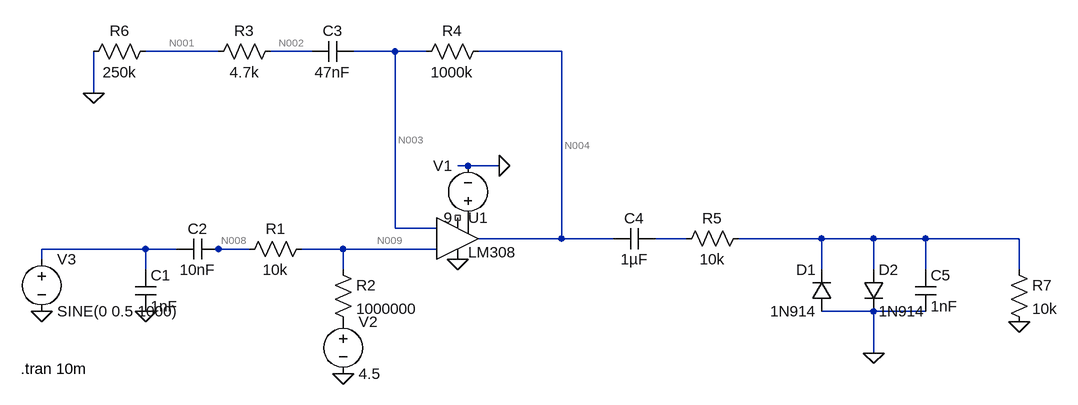
[diagram p0: schematic spice_simulation.asc]
spice_simulation.asc, the LTspice schematic file:
Version 4
SHEET 1 1752 680
WIRE -240 -256 -352 -256
WIRE -96 -256 -160 -256
WIRE 32 -256 -32 -256
WIRE 80 -256 32 -256
WIRE 288 -256 160 -256
WIRE -432 -192 -432 -256
WIRE 144 -80 128 -80
WIRE 192 -80 144 -80
WIRE 32 16 32 -256
WIRE 96 16 32 16
WIRE 288 32 288 -256
WIRE 288 32 160 32
WIRE 368 32 288 32
WIRE 480 32 432 32
WIRE 688 32 560 32
WIRE 768 32 688 32
WIRE 848 32 768 32
WIRE 992 32 848 32
WIRE -352 48 -512 48
WIRE -304 48 -352 48
WIRE -240 48 -256 48
WIRE -192 48 -240 48
WIRE -48 48 -112 48
WIRE 96 48 -48 48
WIRE -512 64 -512 48
WIRE -352 80 -352 48
WIRE -48 80 -48 48
WIRE 688 80 688 32
WIRE 768 80 768 32
WIRE 848 80 848 32
WIRE 992 80 992 32
WIRE 768 144 688 144
WIRE 848 144 768 144
WIRE 768 208 768 144
FLAG -432 -192 0
FLAG -352 144 0
FLAG 768 208 0
FLAG 992 160 0
FLAG -48 240 0
FLAG 192 -80 0
FLAG -512 144 0
FLAG 128 64 0
DATAFLAG 144 -80 ""
DATAFLAG 80 -256 ""
DATAFLAG 80 -256 ""
SYMBOL OpAmps\\LM308 128 -32 R0
WINDOW 3 16 85 Left 2
SYMATTR InstName U1
SYMBOL cap -368 80 R0
SYMATTR InstName C1
SYMATTR Value 1nF
SYMBOL cap -240 32 R90
WINDOW 0 0 32 VBottom 2
WINDOW 3 32 32 VTop 2
SYMATTR InstName C2
SYMATTR Value 10nF
SYMBOL cap -32 -272 R90
WINDOW 0 0 32 VBottom 2
WINDOW 3 32 32 VTop 2
SYMATTR InstName C3
SYMATTR Value 47nF
SYMBOL cap 432 16 R90
WINDOW 0 0 32 VBottom 2
WINDOW 3 32 32 VTop 2
SYMATTR InstName C4
SYMATTR Value 1µF
SYMBOL res -96 32 R90
WINDOW 0 0 56 VBottom 2
WINDOW 3 32 56 VTop 2
SYMATTR InstName R1
SYMATTR Value 10k
SYMBOL res -64 64 R0
SYMATTR InstName R2
SYMATTR Value 1000000
SYMBOL res -144 -272 R90
WINDOW 0 0 56 VBottom 2
WINDOW 3 32 56 VTop 2
SYMATTR InstName R3
SYMATTR Value 4.7k
SYMBOL res 176 -272 R90
WINDOW 0 0 56 VBottom 2
WINDOW 3 32 56 VTop 2
SYMATTR InstName R4
SYMATTR Value 1000k
SYMBOL res 576 16 R90
WINDOW 0 0 56 VBottom 2
WINDOW 3 32 56 VTop 2
SYMATTR InstName R5
SYMATTR Value 10k
SYMBOL cap 832 80 R0
SYMATTR InstName C5
SYMATTR Value 1nF
SYMBOL diode 704 144 R180
WINDOW 0 24 64 Left 2
WINDOW 3 24 0 Left 2
SYMATTR InstName D1
SYMATTR Value 1N914
SYMBOL diode 752 80 R0
SYMATTR InstName D2
SYMATTR Value 1N914
SYMBOL res -336 -272 R90
WINDOW 0 0 56 VBottom 2
WINDOW 3 32 56 VTop 2
SYMATTR InstName R6
SYMATTR Value 250k
SYMBOL res 976 64 R0
SYMATTR InstName R7
SYMATTR Value 10k
SYMBOL voltage 144 16 R180
WINDOW 0 24 96 Left 2
WINDOW 3 24 16 Left 2
WINDOW 123 0 0 Left 0
WINDOW 39 0 0 Left 0
SYMATTR InstName V1
SYMATTR Value 9
SYMBOL voltage -48 144 R0
WINDOW 123 0 0 Left 0
WINDOW 39 0 0 Left 0
SYMATTR InstName V2
SYMATTR Value 4.5
SYMBOL voltage -512 48 R0
WINDOW 123 0 0 Left 0
WINDOW 39 0 0 Left 0
SYMATTR InstName V3
SYMATTR Value SINE(0 0.5 1000)
TEXT -544 232 Left 2 !.tran 10m

The netlist it stands for:
* spice_simulation.asc
XU1 N009 N003 P001 0 N004 NC_01 NC_02 LT1008
C1 N007 0 1nF
C2 N008 N007 10nF
C3 N003 N002 47nF
C4 N005 N004 1µF
R1 N009 N008 10k
R2 N009 P002 1000000
R3 N002 N001 4.7k
R4 N004 N003 1000k
R5 N006 N005 10k
C5 N006 0 1nF
D1 0 N006 1N914
D2 N006 0 1N914
R6 N001 0 250k
R7 N006 0 10k
V1 P001 0 9
V2 P002 0 4.5
V3 N007 0 SINE(0 0.5 1000)
.model D D
.lib standard.dio
.tran 10m
.lib LTC.lib
.backanno
.end

* Results of the author's LTspice run, read from the files saved beside the schematic
* Operating Point, zero values left out:
*   V(n003) = 4.5 V
*   V(n009) = 4.5 V
*   V(p001) = 9 V
*   V(n004) = 4.5 V
*   V(n008) = 4.5 V
*   V(p002) = 4.5 V
*   I(V1) = -393.9 µA
*   Ix(u1:3) = 393.9 µA
*   Ix(u1:4) = -393.9 µA
*   Ix(u1:6) = -4.585 pA
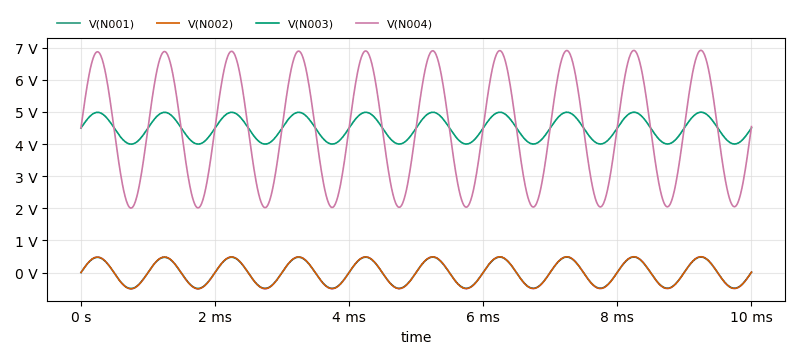
[diagram p1: Transient Analysis of spice_simulation.asc, plotted from the saved traces]
* Transient Analysis, 1 run:
*   V(N001): min -498 mV, max 481.6 mV, average -7.45 mV, rms 343 mV, last 10.27 mV
*   V(N002): min -507.4 mV, max 490.7 mV, average -7.59 mV, rms 349.5 mV, last 10.46 mV
*   V(N003): min 3.998 V, max 4.991 V, average 4.495 V, rms 4.509 V, last 4.504 V
*   V(N004): min 2.006 V, max 6.918 V, average 4.465 V, rms 4.786 V, last 4.544 V